# Altium schematic sheet Sheet1.SchDoc
size A
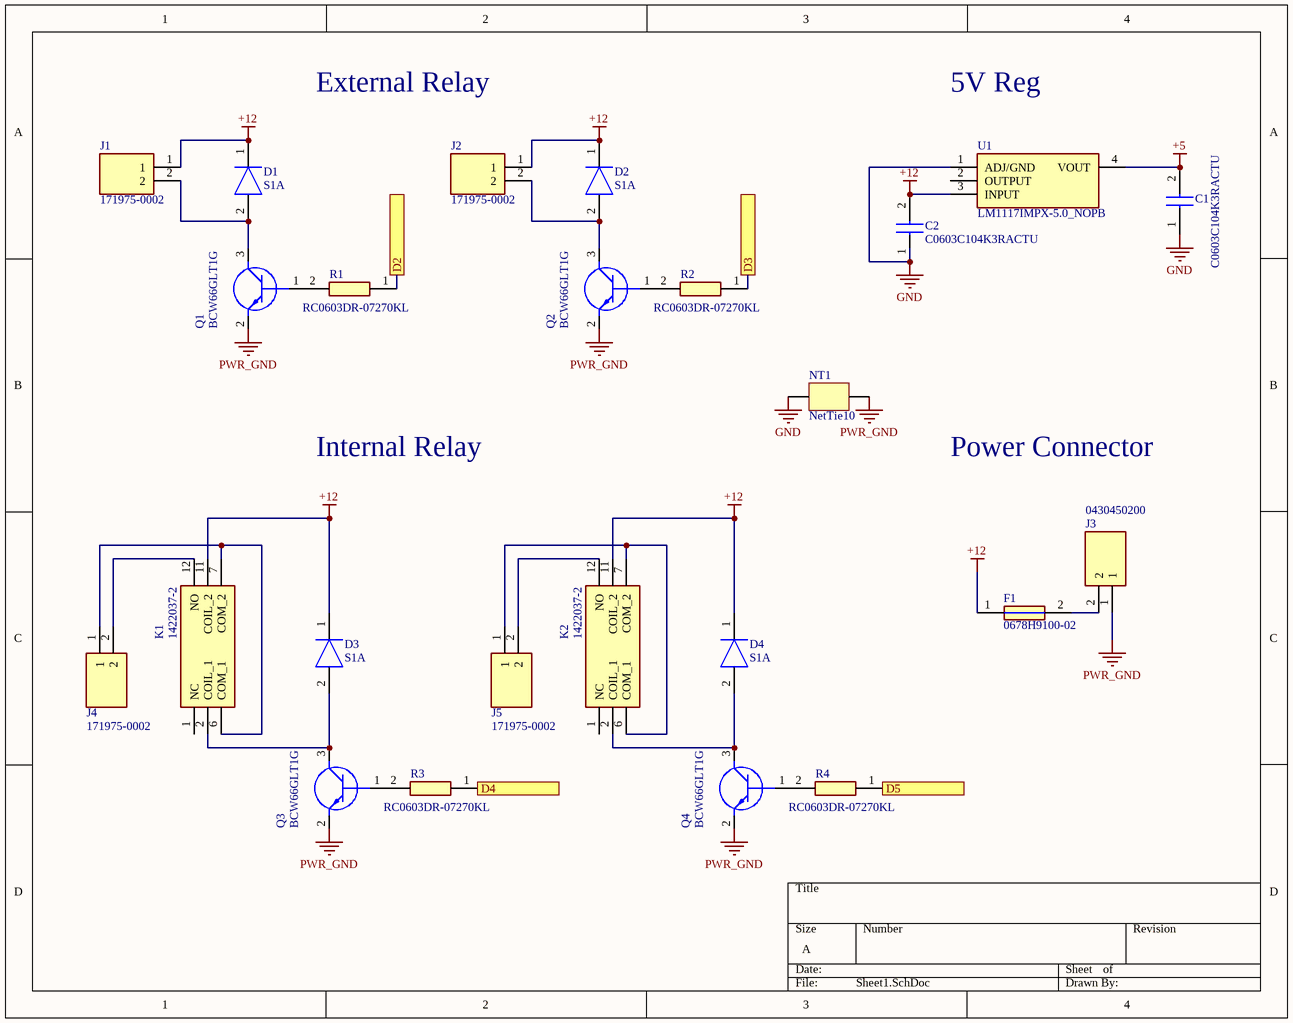
[diagram p0: Sheet1.SchDoc]

## Parts
C1  C0603C104K3RACTU  [CAPC1608X95N]
C2  C0603C104K3RACTU  [CAPC1608X95N]
D1  S1A  [DIOM5227X270N]
D2  S1A  [DIOM5227X270N]
D3  S1A  [DIOM5227X270N]
D4  S1A  [DIOM5227X270N]
F1  0678H9100-02  [FUSC9830X318N]
J1  171975-0002  [1719750002]
J2  171975-0002  [1719750002]
J3  0430450200  [43045-0200]
J4  171975-0002  [1719750002]
J5  171975-0002  [1719750002]
K1  1422037-2  [14220372]
K2  1422037-2  [14220372]
NT1  NetTie10  [NetTie]  (net tie, no BOM)
Q1  BCW66GLT1G  [SOT95P237X111-3N]
Q2  BCW66GLT1G  [SOT95P237X111-3N]
Q3  BCW66GLT1G  [SOT95P237X111-3N]
Q4  BCW66GLT1G  [SOT95P237X111-3N]
R1  RC0603DR-07270KL  [RESC1608X55N]
R2  RC0603DR-07270KL  [RESC1608X55N]
R3  RC0603DR-07270KL  [RESC1608X55N]
R4  RC0603DR-07270KL  [RESC1608X55N]
U1  LM1117IMPX-5.0_NOPB  [SOT230P700X180-4N]

## Ports
D2, D3, D4, D5

## Nets
+5: C1.2 U1.4(VOUT)
+12: C2.2 D1.1(K) D2.1(K) D3.1(K) D4.1(K) F1.1 J1.1 J2.1 K1.11(COIL_2) K2.11(COIL_2) U1.3(INPUT)
GND: C1.1 C2.1 NT1.1 U1.1(ADJ/GND)
PWR_GND: J3.1 NT1.2 Q1.2(E) Q2.2(E) Q3.2(E) Q4.2(E)
D2: R1.1 ; port D2
D3: R2.1 ; port D3
D4: R3.1 ; port D4
D5: R4.1 ; port D5
NetD1_2: D1.2(A) J1.2 Q1.3(C)
NetD2_2: D2.2(A) J2.2 Q2.3(C)
NetD3_2: D3.2(A) K1.2(COIL_1) Q3.3(C)
NetD4_2: D4.2(A) K2.2(COIL_1) Q4.3(C)
NetF1_2: F1.2 J3.2
NetJ4_1: J4.1 K1.6(COM_1) K1.7(COM_2)
NetJ4_2: J4.2 K1.12(NO)
NetJ5_1: J5.1 K2.6(COM_1) K2.7(COM_2)
NetJ5_2: J5.2 K2.12(NO)
NetQ1_1: Q1.1(B) R1.2
NetQ2_1: Q2.1(B) R2.2
NetQ3_1: Q3.1(B) R3.2
NetQ4_1: Q4.1(B) R4.2

Not connected (* = marked no-connect by the designer): K1 1(NC); K2 1(NC); U1 2(OUTPUT)

## Notes on the sheet
- External Relay
- 5V Reg
- Internal Relay
- Power Connector

## Library data of the parts
C1 C2 = C0603C104K3RACTU: Capacitor; Manufacturer_Name: Kemet; Datasheet Link: https://content.kemet.com/datasheets/KEM_C1002_X7R_SMD.pdf; Height: 0.95mm; Manufacturer_Part_Number: C0603C104K3RACTU; Mouser Part Number: 80-C0603C104K3R; Mouser Price/Stock: https://www.mouser.co.uk/ProductDetail/KEMET/C0603C104K3RACTU/?qs=l5k%252BbMnNDklvfdneglCDAg%3D%3D; Arrow Part Number: C0603C104K3RACTU; Arrow Price/Stock: https://www.arrow.com/en/products/c0603c104k3ractu/kemet-corporation
D1-D4 = S1A: Diode; Manufacturer_Name: ON Semiconductor; Datasheet Link: http://www.onsemi.com/pub/Collateral/S1M-D.pdf; Height: 2.7mm; Manufacturer_Part_Number: S1A; Mouser Part Number: 512-S1A; Mouser Price/Stock: https://www.mouser.co.uk/ProductDetail/ON-Semiconductor-Fairchild/S1A/?qs=RJwZ8kJo1mjAagviH5vK9g%3D%3D; Arrow Part Number: S1A; Arrow Price/Stock: https://www.arrow.com/en/products/s1a/on-semiconductor
F1 = 0678H9100-02: Fuse; Manufacturer_Name: Bel; Datasheet Link: https://www.mouser.com/datasheet/2/643/Bel Fuse_02202018_0678H-1288534.pdf; Height: 3.18mm; Manufacturer_Part_Number: 0678H9100-02; Mouser Part Number: 530-0678H9100-02
J1 J2 J4 J5 = 171975-0002: Connector; Manufacturer_Name: Molex; Datasheet Link: https://www.molex.com/pdm_docs/sd/1719750002_sd.pdf; Height: 7.38mm; Manufacturer_Part_Number: 171975-0002; Mouser Part Number: 538-171975-0002; Mouser Price/Stock: https://www.mouser.co.uk/ProductDetail/Molex/171975-0002?qs=lc2O%252BfHJPVZp75AIAAjPAw%3D%3D
J3 = 0430450200: Connector; Manufacturer_Name: Molex; Datasheet Link: http://www.molex.com/webdocs/datasheets/pdf/en-us//0430450200_PCB_HEADERS.pdf; Manufacturer_Part_Number: 0430450200; Mouser Part Number: N/A; Mouser Price/Stock: https://www.mouser.com/Search/Refine.aspx?Keyword=N%2FA; Arrow Part Number: 0430450200; Arrow Price/Stock: https://www.arrow.com/en/products/0430450200/molex
K1 K2 = 1422037-2: Relay or Contactor; Manufacturer_Name: TE Connectivity; Datasheet Link: https://www.te.com/commerce/DocumentDelivery/DDEController?Action=srchrtrv&DocNm=108-98010&DocType=SS&DocLang=EN; Height: 11.7mm; Manufacturer_Part_Number: 1422037-2; Mouser Part Number: 655-1422037-2; Mouser Price/Stock: https://www.mouser.com/Search/Refine.aspx?Keyword=655-1422037-2
Q1-Q4 = BCW66GLT1G: Transistor BJT NPN; Manufacturer_Name: ON Semiconductor; Datasheet Link: http://www.onsemi.com/pub/Collateral/BCW66GLT1-D.PDF; Height: 1.11mm; Manufacturer_Part_Number: BCW66GLT1G; Mouser Part Number: 863-BCW66GLT1G; Mouser Price/Stock: https://www.mouser.co.uk/ProductDetail/ON-Semiconductor/BCW66GLT1G?qs=R2UZ7gjkEjKs0bN2RlXbWw%3D%3D; Arrow Part Number: BCW66GLT1G; Arrow Price/Stock: https://www.arrow.com/en/products/bcw66glt1g/on-semiconductor
R1-R4 = RC0603DR-07270KL: Resistor; Manufacturer_Name: YAGEO (PHYCOMP); Datasheet Link: http://www.yageo.com/documents/recent/PYu-RC0603_51_RoHS_L_v5.pdf; Height: 0.55mm; Manufacturer_Part_Number: RC0603DR-07270KL; Arrow Part Number: RC0603DR-07270KL; Arrow Price/Stock: https://www.arrow.com/en/products/rc0603dr-07270kl/yageo
U1 = LM1117IMPX-5.0_NOPB: Undefined or Miscellaneous; Manufacturer_Name: Texas Instruments; Manufacturer_Part_Number: LM1117IMPX-5.0/NOPB; Datasheet Link: http://www.ti.com/lit/gpn/lm1117; Height: 1.8mm; Mouser Part Number: 926-LM1117IMPX50NOPB; Mouser Price/Stock: https://www.mouser.co.uk/ProductDetail/Texas-Instruments/LM1117IMPX-50-NOPB?qs=X1J7HmVL2ZGGwLlD0uGqKQ%3D%3D; Arrow Part Number: LM1117IMPX-5.0/NOPB; Arrow Price/Stock: https://www.arrow.com/en/products/lm1117impx-5.0nopb/texas-instruments